# EAGLE design Blaze (EAGLE 9.6.1)
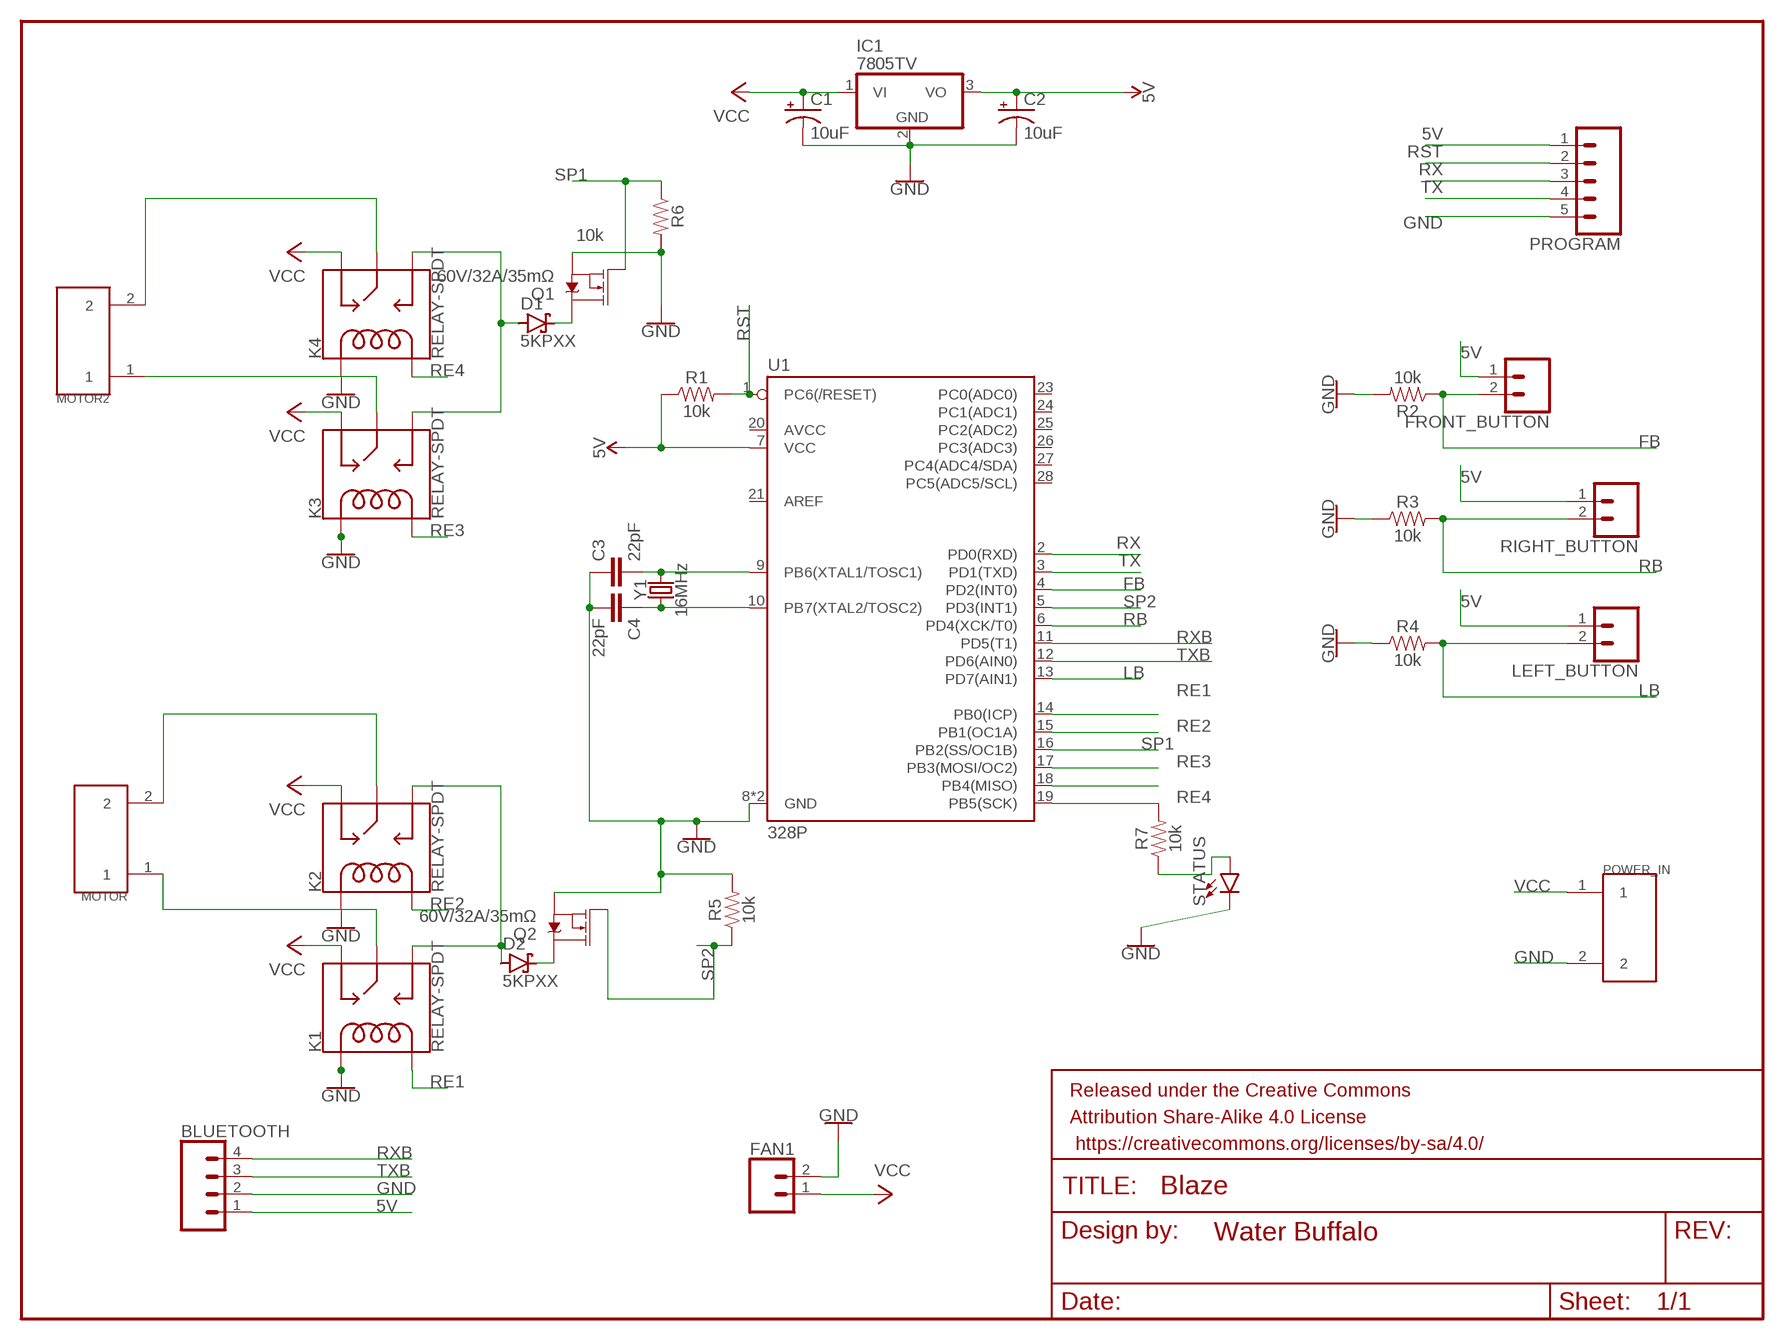
[diagram p0: schematic, sheet 1]

## Parts
BLUETOOTH  CONN_04PTH  [1X04]
C1  10uF  10UF-POLAR-RADIAL-2.5MM-25V-20%  [CPOL-RADIAL-2.5MM-5MM]
C2  10uF  10UF-POLAR-RADIAL-2.5MM-25V-20%  [CPOL-RADIAL-2.5MM-5MM]
C3  22pF  22PF-PTH-2.54MM-200V-5%  [CAP-PTH-2.54]
C4  22pF  22PF-PTH-2.54MM-200V-5%  [CAP-PTH-2.54]
D1  5KPXX  [P6T15]
D2  5KPXX  [P6T15]
FAN1  CONN_02  [1X02]
FRAME1  FRAME-LETTERNO_PACKAGE  [DUMMY]
FRONT_BUTTON  CONN_02  [1X02]
IC1  7805TV  [TO220V]
K1  RELAY-SPDT  [RELAY_G5LE]
K2  RELAY-SPDT  [RELAY_G5LE]
K3  RELAY-SPDT  [RELAY_G5LE]
K4  RELAY-SPDT  [RELAY_G5LE]
LEFT_BUTTON  CONN_02  [1X02]
MOTOR  10M_TERM  [10MM_TERM]
MOTOR2  10M_TERM  [10MM_TERM]
POWER_IN  10M_TERM  [10MM_TERM]
PROGRAM  CONN_05  [1X05]
Q1  60V/32A/35mΩ  MOSFET-NCH-FQP30N06L  [TO220V]
Q2  60V/32A/35mΩ  MOSFET-NCH-FQP30N06L  [TO220V]
R1  10k  10KOHM-HORIZ-1/4W-1%  [AXIAL-0.3]
R2  10k  10KOHM-HORIZ-1/4W-1%  [AXIAL-0.3]
R3  10k  10KOHM-HORIZ-1/4W-1%  [AXIAL-0.3]
R4  10k  10KOHM-HORIZ-1/4W-1%  [AXIAL-0.3]
R5  10k  10KOHM-HORIZ-1/4W-1%  [AXIAL-0.3]
R6  10k  10KOHM-HORIZ-1/4W-1%  [AXIAL-0.3]
R7  10k  10KOHM-HORIZ-1/4W-1%  [AXIAL-0.3]
RIGHT_BUTTON  CONN_02  [1X02]
STATUS  LED3MM  [LED_3MM]
U1  328P  ATMEGA328P_PDIP  [DIP28]
Y1  16MHz  CRYSTAL-16MHZPTH-HC49US  [HC49US]

## Nets
5V: BLUETOOTH.1 C2.1(+) FRONT_BUTTON.1 IC1.3(VO) LEFT_BUTTON.1 PROGRAM.1 R1.P$1 RIGHT_BUTTON.1 U1.7(VCC)
FB: FRONT_BUTTON.2 R2.P$1 U1.4(PD2(INT0))
GND: BLUETOOTH.2 C1.2(-) C2.2(-) C3.1 C4.2 FAN1.2 IC1.2(GND) K1.2(COIL1) K2.2(COIL1) K3.2(COIL1) K4.2(COIL1) POWER_IN.2 PROGRAM.5 Q1.3(S) Q2.3(S) R2.P$2 R3.P$1 R4.P$1 R5.P$2 R6.P$2 STATUS.K(C) U1.8(GND) U1.22(GND)
LB: LEFT_BUTTON.2 R4.P$2 U1.13(PD7(AIN1))
MOTOR2_1 [Motor]: K3.1(MAIN) MOTOR2.1
MOTOR2_2 [Motor]: K4.1(MAIN) MOTOR2.2
N$1 [Motor]: D2.A K1.3(NO) K2.3(NO)
N$2 [Motor]: D1.C Q1.2(D)
N$3 [Motor]: K2.1(MAIN) MOTOR.2
N$4 [Motor]: K1.1(MAIN) MOTOR.1
N$5: R7.P$1 STATUS.A
N$7 [Motor]: D1.A K3.3(NO) K4.3(NO)
N$8 [Motor]: D2.C Q2.2(D)
N$11: C3.2 U1.9(PB6(XTAL1/TOSC1)) Y1.2
N$12: C4.1 U1.10(PB7(XTAL2/TOSC2)) Y1.1
RB: R3.P$2 RIGHT_BUTTON.2 U1.6(PD4(XCK/T0))
RE1: K1.5(COIL2) U1.14(PB0(ICP))
RE2: K2.5(COIL2) U1.15(PB1(OC1A))
RE3: K3.5(COIL2) U1.17(PB3(MOSI/OC2))
RE4: K4.5(COIL2) U1.18(PB4(MISO))
RST: PROGRAM.2 R1.P$2 U1.1(PC6(/RESET))
RX: PROGRAM.3 U1.2(PD0(RXD))
RXB: BLUETOOTH.4 U1.11(PD5(T1))
SP1: Q1.1(G) R6.P$1 U1.16(PB2(SS/OC1B))
SP2: Q2.1(G) R5.P$1 U1.5(PD3(INT1))
STAT_LED: R7.P$2 U1.19(PB5(SCK))
TX: PROGRAM.4 U1.3(PD1(TXD))
TXB: BLUETOOTH.3 U1.12(PD6(AIN0))
VCC [VCC]: C1.1(+) FAN1.1 IC1.1(VI) K1.4(NC) K2.4(NC) K3.4(NC) K4.4(NC) POWER_IN.1
Unconnected: U1.20(AVCC) U1.21(AREF) U1.23(PC0(ADC0)) U1.24(PC1(ADC1)) U1.25(PC2(ADC2)) U1.26(PC3(ADC3)) U1.27(PC4(ADC4/SDA)) U1.28(PC5(ADC5/SCL))

## Library data of the parts
BLUETOOTH = SparkFun-Connectors:CONN_04: Multi connection point. Often used as Generic Header-pin footprint for 0.1 inch spaced/style header connections On any of the 0.1 inch spaced packages, you can populate with these: Break Away Headers - Straight <https://www.sparkfun.com/products/116> (PRT-00116) Break Away Male Headers - Right Angle <https://www.sparkfun.com/products/553> (PRT-00553) Female Headers <https://www.sparkfun.com/products/115> (PRT-00115) Break Away Headers - Machine Pin <https://www.sparkfun.com/products/117> (PRT-00117) Break Away Female Headers - Swiss Machine Pin <https://www.sparkfun.com/products/743> (PRT-00743) For SCREWTERMINALS and SPRING TERMINALS visit here: Screw Terimnals on SparkFun.com <https://www.sparkfun.com/search/results?term=Screw+Terminals> (5mm/3.5mm/2.54mm spacing) This device is also useful as a general connection point to wire up your design to another part of your project. Our various solder wires solder well into these plated through hole pads. Hook-Up Wire - Assortment (Stranded, 22 AWG) <https://www.sparkfun.com/products/11375> (PRT-11375) Hook-Up Wire - Assortment (Solid Core, 22 AWG) <https://www.sparkfun.com/products/11367> (PRT-11367) View the entire wire category on our website here <https://www.sparkfun.com/categories/141> Special notes: Molex polarized connector foot print use with SKU : PRT-08231 with associated crimp pins and housings. 1MM SMD Version SKU: PRT-10208; PROD_ID: CONN-09696
C1 C2 = SparkFun-Capacitors:10UF-POLAR: 10.0µF polarized capacitors A capacitor is a passive two-terminal electrical component used to store electrical energy temporarily in an electric field.; PROD_ID: CAP-08440
C3 C4 = SparkFun-Capacitors:22PF: 22pF ceramic capacitors A capacitor is a passive two-terminal electrical component used to store electrical energy temporarily in an electric field.; PROD_ID: CAP-09128
D1 D2 = diode:5KPXX: DIODE transient voltage suppressor
FAN1 FRONT_BUTTON LEFT_BUTTON RIGHT_BUTTON = SparkFun-Connectors:CONN_02: Multi connection point. Often used as Generic Header-pin footprint for 0.1 inch spaced/style header connections On any of the 0.1 inch spaced packages, you can populate with these: Break Away Headers - Straight <https://www.sparkfun.com/products/116> (PRT-00116) Break Away Male Headers - Right Angle <https://www.sparkfun.com/products/553> (PRT-00553) Female Headers <https://www.sparkfun.com/products/115> (PRT-00115) Break Away Headers - Machine Pin <https://www.sparkfun.com/products/117> (PRT-00117) Break Away Female Headers - Swiss Machine Pin <https://www.sparkfun.com/products/743> (PRT-00743) For SCREWTERMINALS and SPRING TERMINALS visit here: Screw Terimnals on SparkFun.com <https://www.sparkfun.com/search/results?term=Screw+Terminals> (5mm/3.5mm/2.54mm spacing) This device is also useful as a general connection point to wire up your design to another part of your project. Our various solder wires solder well into these plated through hole pads. Hook-Up Wire - Assortment (Stranded, 22 AWG) <https://www.sparkfun.com/products/11375> (PRT-11375) Hook-Up Wire - Assortment (Solid Core, 22 AWG) <https://www.sparkfun.com/products/11367> (PRT-11367) View the entire wire category on our website here <https://www.sparkfun.com/categories/141> Special notes: Molex polarized connector foot print use with: PRT-08233 with associated crimp pins and housings. 2.54_SCREWTERM for use with PRT-10571. 3.5mm Screw Terminal footprints for PRT-08084 5mm Screw Terminal footprints for use with PRT-08432
FRAME1 = SparkFun-Aesthetics:FRAME-LETTER: Schematic Frame - Letter Standard 8.5x11 US Letter frame; DESIGNER: Water Buffalo; VERSION: v01
IC1 = linear:78*: Positive VOLTAGE REGULATOR Source: http://cache.national.com/ds/LM/LM78L05.pdf http://www.fairchildsemi.com/ds/LM/LM7805.pdf
K1-K4 = SparkFun-Electromechanical:RELAY-SPDT: SPDT Electromechanical Relay Single-pole, double-throw sealed relays. When current is applied to the coil, it throws a simple changeover switch, terminating the connection from the NC contact to ground and closing the NO contact. Use them to switch high voltage/high current devices. SparkFun Products JQX-15F: Relay SPDT Sealed - 20A <https://www.sparkfun.com/products/10924> (COM-10924) JZC-11F: Relay SPDT Sealed <https://www.sparkfun.com/products/100> (COM-00100); PROD_ID: COMP-14214
MOTOR MOTOR2 POWER_IN = 10mm_term:10M_TERM
PROGRAM = SparkFun-Connectors:CONN_05: Multi connection point. Often used as Generic Header-pin footprint for 0.1 inch spaced/style header connections On any of the 0.1 inch spaced packages, you can populate with these: Break Away Headers - Straight <https://www.sparkfun.com/products/116> (PRT-00116) Break Away Male Headers - Right Angle <https://www.sparkfun.com/products/553> (PRT-00553) Female Headers <https://www.sparkfun.com/products/115> (PRT-00115) Break Away Headers - Machine Pin <https://www.sparkfun.com/products/117> (PRT-00117) Break Away Female Headers - Swiss Machine Pin <https://www.sparkfun.com/products/743> (PRT-00743) For SCREWTERMINALS and SPRING TERMINALS visit here: Screw Terimnals on SparkFun.com <https://www.sparkfun.com/search/results?term=Screw+Terminals> (5mm/3.5mm/2.54mm spacing) This device is also useful as a general connection point to wire up your design to another part of your project. Our various solder wires solder well into these plated through hole pads. Hook-Up Wire - Assortment (Stranded, 22 AWG) <https://www.sparkfun.com/products/11375> (PRT-11375) Hook-Up Wire - Assortment (Solid Core, 22 AWG) <https://www.sparkfun.com/products/11367> (PRT-11367) View the entire wire category on our website here <https://www.sparkfun.com/categories/141> Special notes: Molex polarized connector foot print use with SKU : PRT-08231 with associated crimp pins and housings. 1MM SMD Version SKU: PRT-10208
Q1 Q2 = SparkFun-DiscreteSemi:MOSFET-NCH: N-channel MOSFETs Voltage controlled devices that allow control of high current outputs. SparkFun Products: SparkFun OpenScale <https://www.sparkfun.com/products/13261> SparkFun Digital Sandbox <https://www.sparkfun.com/products/12651> SparkFun Monster Moto Shield <https://www.sparkfun.com/products/10182> SparkFun MOSFET Power Controller <https://www.sparkfun.com/products/11214>; PROD_ID: TRANS-10060
R1-R7 = SparkFun-Resistors:10KOHM: 10kΩ resistor A resistor is a passive two-terminal electrical component that implements electrical resistance as a circuit element. Resistors act to reduce current flow, and, at the same time, act to lower voltage levels within circuits. - Wikipedia; PROD_ID: RES-12183
STATUS = SparkFun-LED:LED: LED (Generic) Standard schematic elements and footprints for 5mm, 3mm, 1206, and 0603 sized LEDs. Generic LEDs with no color specified.; PROD_ID: DIO-08794
U1 = SparkFun-IC-Microcontroller:ATMEGA328P_PDIP: Atmel 328P Through hole ATMEGA328P uC used in the Arduino 32kb flash, 1k EEPROM, 2k SRAM Datasheet <http://www.sparkfun.com/datasheets/Components/SMD/ATMega328.pdf> SparkFun Products Storefront component: AVR 28 Pin 20MHz 32K 6A/D - ATMega328P <https://www.sparkfun.com/products/9061> (COM-09061) SparkFun Simon Says - Through-Hole Soldering Kit <https://www.sparkfun.com/products/10547> (KIT-10547) SparkFun Learn to Solder - Simon Says <https://www.sparkfun.com/products/13708> (KIT-13708) SparkFun BigTime Watch Kit <https://www.sparkfun.com/products/11734> (KIT-11734) SparkFun ClockIt <https://www.sparkfun.com/products/10930> (KIT-10930) SparkFun Serial Enabled LCD Kit <https://www.sparkfun.com/products/10097> (LCD-10097) SparkFun Simon Tilts - Through Hole Soldering Kit <https://www.sparkfun.com/products/12634> (KIT-12634) SparkFun Frequency Counter Kit <https://www.sparkfun.com/products/10140> (KIT-10140) FabFM Radio Kit <https://www.sparkfun.com/products/11043> (KIT-11043) SparkFun Binary Blaster Kit <https://www.sparkfun.com/products/12037> (KIT-12037) SparkFun Metro-Gnome <https://www.sparkfun.com/products/9236> (KIT-09236) ATmega328 with Arduino Optiboot (Uno) <https://www.sparkfun.com/products/10524> (DEV-10524); PROD_ID: IC-09136
Y1 = SparkFun-Clocks:CRYSTAL-16MHZ: 16MHz Crystal Digikey Example <http://www.digikey.com/product-search/en?keywords=535-9122-1-ND> Frequency: 16MHz Frequency Stability: ±50ppm Frequency Tolerance: ±20ppm Load Capacitance: 18pF SparkFun Products: Pro Micro -5V/16MHz <https://www.sparkfun.com/products/12640> SparkFun Serial Enabled LCD Kit <https://www.sparkfun.com/products/10097>; PROD_ID: XTAL-08181; SF_ID: COM-00536

## Net classes
0 default: width 0.15 mm
1 Motor: width 2 mm, clearance 0.508 mm
2 VCC: clearance 0.762 mm

## Board
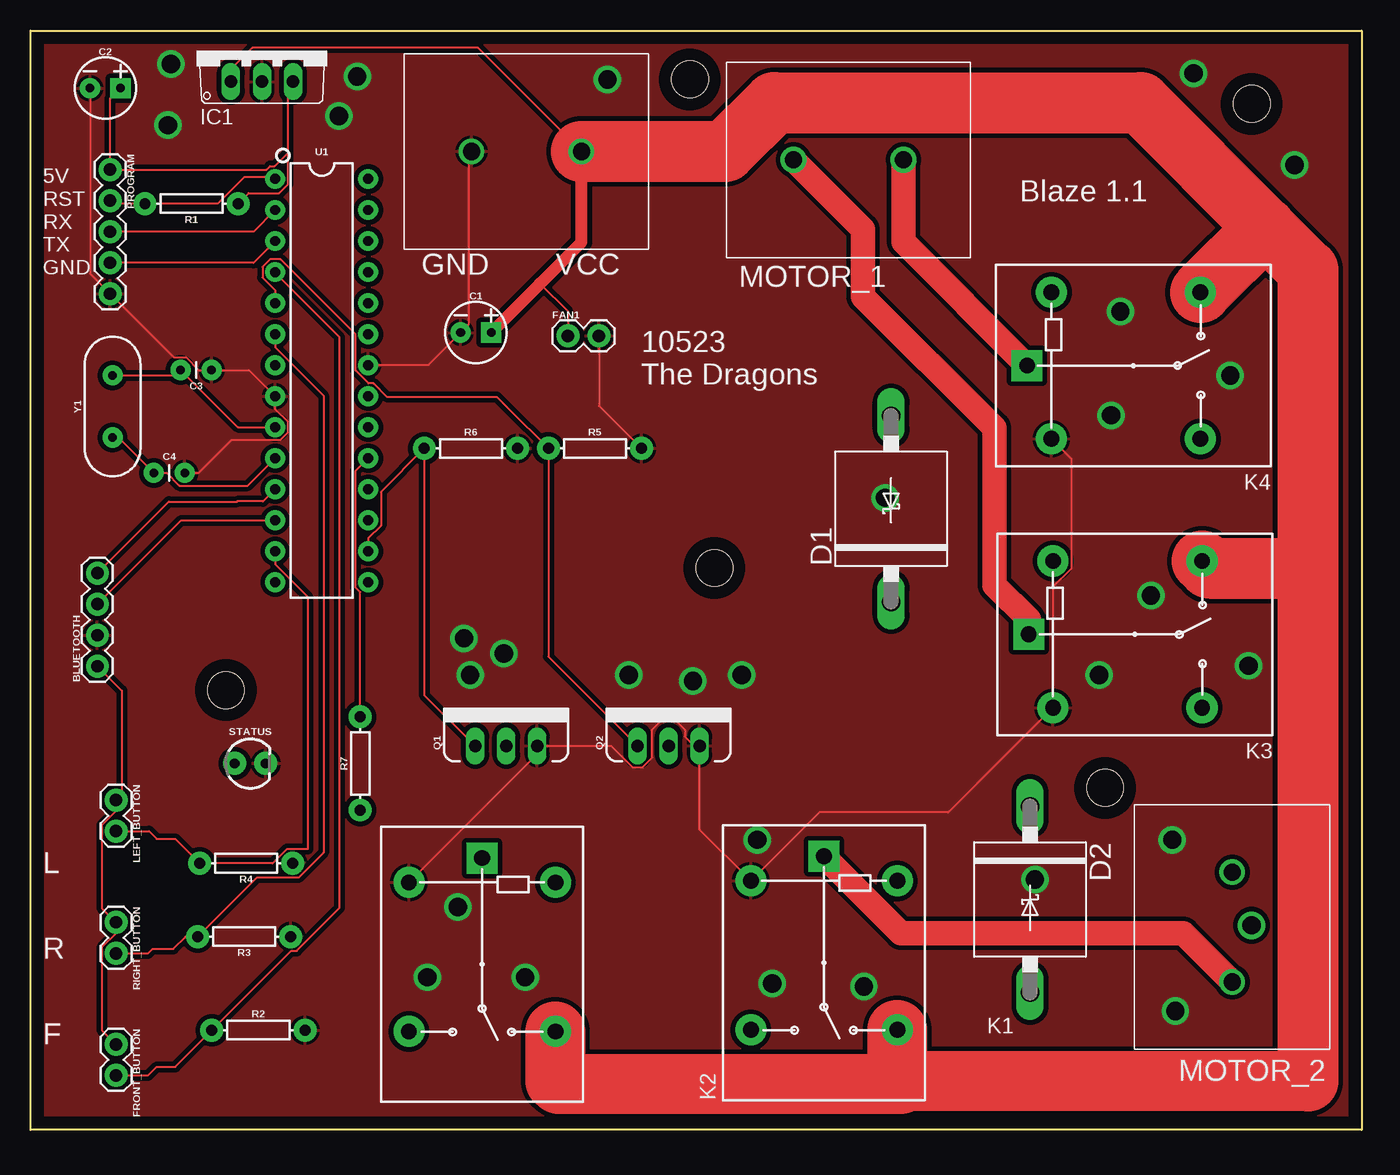
[diagram p1: board, top side]
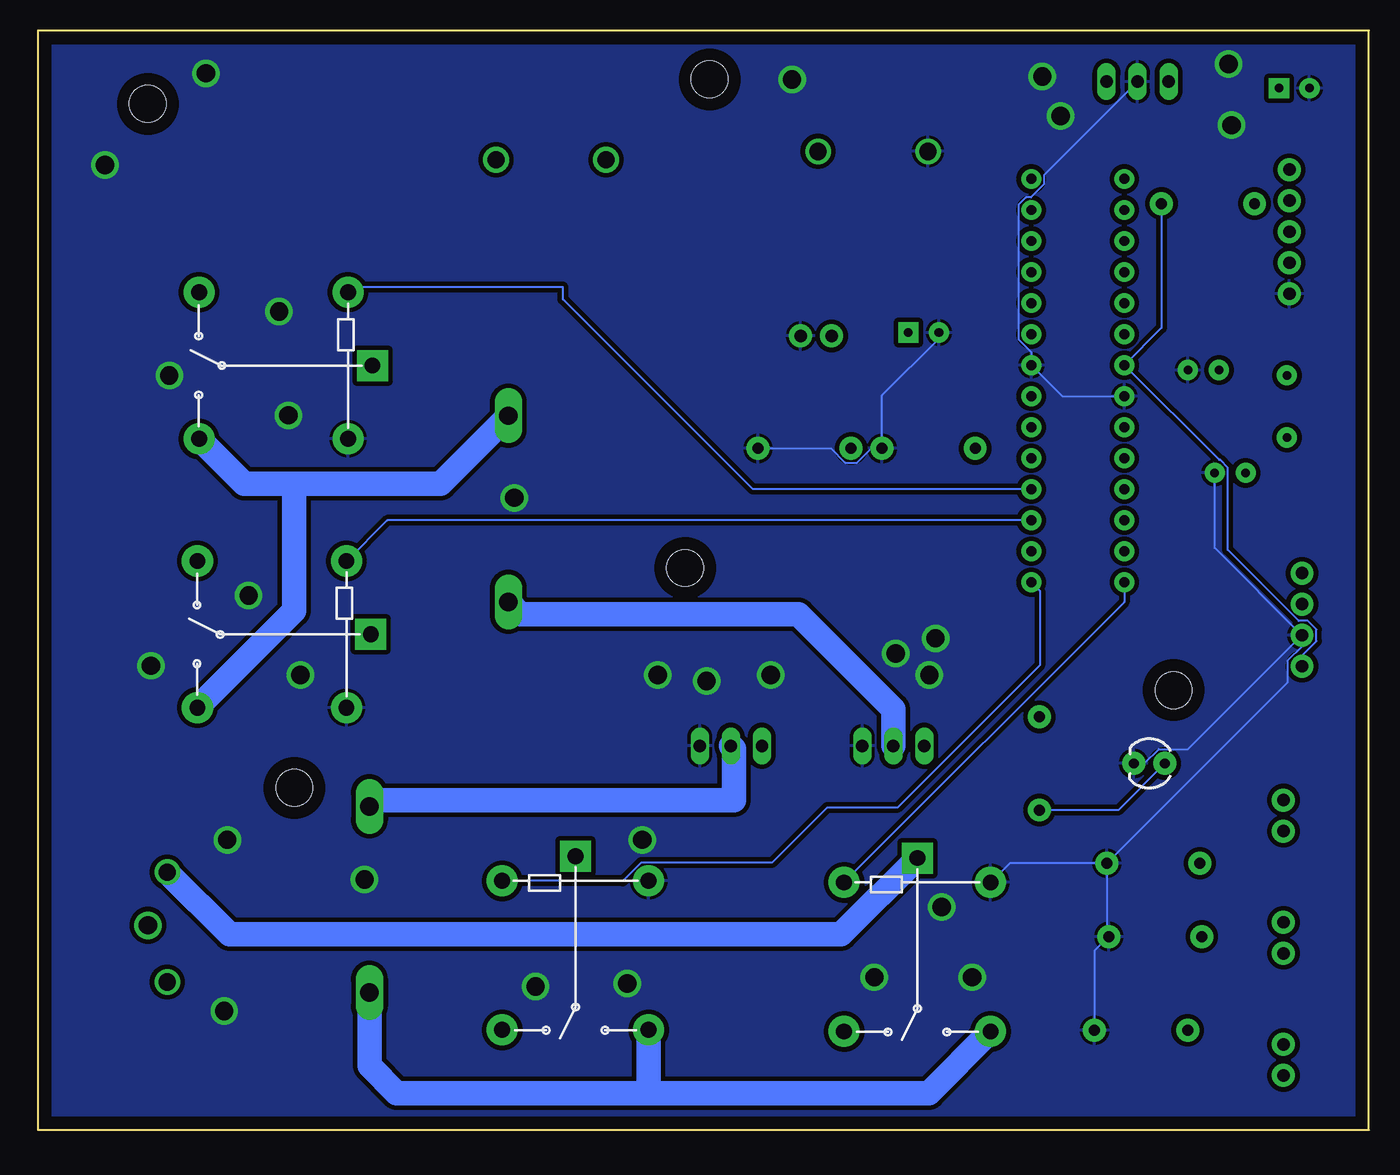
[diagram p2: board, bottom side, seen from below]

Size 109 x 90 mm. Coordinates in mm from the lower left corner, seen from the top.
Outline: 0,0 0,90 109,90 109,0 0,0
Copper layers (1*16): Top 0.035mm / dielectric 1.5mm / Bottom 0.035mm
Design rules "default *": minimum track width 6mil, minimum drill 0.35mm, track to track 15mil, track to pad 6mil, pad to pad 6mil, via to via 6mil, smd to smd 6mil, copper to edge 40mil, drill to drill 6mil, minimum pad ring 10mil, minimum via ring 8mil, stop-mask expansion 4mil, vias tented up to drill 0mil, thermal gap 10mil
Holes 3 mm at 100,84 56,46 16,36 88,28 54,86

### Footprints (pad centres in the part's own frame; a part is rotated, then mirrored left to right if it is on the bottom)
1X04 = drill 1.016 pad 1.88: 1 0,0; 2 2.54,0; 3 5.08,0; 4 7.62,0
CPOL-RADIAL-2.5MM-5MM = drill 0.7 pad 1.651 square: 1 1.25,0 | drill 0.7 pad 1.651: 2 -1.25,0
CAP-PTH-2.54 = drill 0.7 pad 1.651: 1 -1.27,0; 2 1.27,0
P6T15 = drill 1.499 long: A 7.62,0; C -7.62,0
1X02 = drill 1.016 pad 1.88: 1 0,0; 2 2.54,0
TO220V = drill 1.016 long: 1 -2.54,-2.54; 2 0,-2.54; 3 2.54,-2.54
RELAY_G5LE = drill 1.3 pad 2.54 square: 1 8.52,-0.005 | drill 1.3 pad 2.54: 2 6.52,5.995; 3 -5.68,5.995; 4 -5.68,-6.005; 5 6.52,-6.005
10MM_TERM = drill 1.4: 1 0,4.5; 2 0,-4.5
1X05 = drill 1.016 pad 1.88: 1 0,0; 2 2.54,0; 3 5.08,0; 4 7.62,0; 5 10.16,0
TO220V' = drill 1.016 long: 1 -2.54,0; 2 0,0; 3 2.54,0
AXIAL-0.3 = drill 0.9 pad 1.88: P$1 -3.81,0; P$2 3.81,0
LED_3MM = drill 0.813 pad 1.88: A -1.27,0; K 1.27,0
DIP28 = drill 0.813 pad 1.626: 1 -16.51,-3.81; 2 -13.97,-3.81; 3 -11.43,-3.81; 4 -8.89,-3.81; 5 -6.35,-3.81; 6 -3.81,-3.81; 7 -1.27,-3.81; 8 1.27,-3.81; 9 3.81,-3.81; 10 6.35,-3.81; 11 8.89,-3.81; 12 11.43,-3.81; 13 13.97,-3.81; 14 16.51,-3.81; 15 16.51,3.81; 16 13.97,3.81; 17 11.43,3.81; 18 8.89,3.81; 19 6.35,3.81; 20 3.81,3.81; 21 1.27,3.81; 22 -1.27,3.81; 23 -3.81,3.81; 24 -6.35,3.81; 25 -8.89,3.81; 26 -11.43,3.81; 27 -13.97,3.81; 28 -16.51,3.81
HC49US = drill 0.7 pad 1.651: 1 -2.54,0; 2 2.54,0

### Placement (x,y rotation side)
BLUETOOTH  5.48,37.96 90 top
C1  36.47,65.28 0 top
C2  6.12,85.28 0 top
C3  13.56,62.21 180 top
C4  11.36,53.79 0 top
D1  70.47,50.85 90 top
D2  81.85,18.86 270 top
FAN1  44,65 0 top
FRAME1  7.48,40.15 90 top
FRONT_BUTTON  7,7 270 top
IC1  18.95,88.36 0 top
K1  36.98,13.74 90 top
K2  64.98,13.87 90 top
K3  90.26,40.57 180 top
K4  90.13,62.57 180 top
LEFT_BUTTON  7,27 270 top
MOTOR  98.41,16.61 0 top
MOTOR2  66.98,79.42 90 top
POWER_IN  40.61,80.1 270 top
PROGRAM  6.52,78.61 270 top
Q1  60V/32A/35mΩ  [TO220V']  38.95,31.44 0 top
Q2  60V/32A/35mΩ  [TO220V']  52.25,31.44 0 top
R1  13.18,75.83 180 top
R2  18.66,8.17 0 top
R3  17.5,15.83 180 top
R4  17.66,21.83 180 top
R5  46.22,55.79 0 top
R6  36.06,55.79 0 top
R7  27,30 90 top
RIGHT_BUTTON  7,17 270 top
STATUS  18,30 0 top
U1  23.85,61.34 270 top
Y1  6.72,59.23 90 top

### Tracks (layer width: path | path; a pad name or v marks a point on that pad's centre or on a via)
5V
  Top 0.152: C2.1 6.52,84.43 PROGRAM.1 19.33,78.61 19.61,78.89 19.97,78.89 21.08,80 | R1.P$1 17.85,76.69 20.36,76.69 21.08,77.42 21.08,80 | IC1.3 21.08,85.41 21.08,80 | BLUETOOTH.1 7.48,35.96 7.48,27.48 LEFT_BUTTON.1 7,26.11 5.83,24.94 5.83,18.17 RIGHT_BUTTON.1 7,16.11 5.83,14.94 5.83,8.17 FRONT_BUTTON.1
  Bottom 0.152: R1.P$1 16.99,65.66 U1.7 12.27,54.84 12.19,54.84 11.58,54.23 11.58,47.48 5.76,41.67 5,41.67 4.31,40.98 4.31,40.02 5.48,38.85 BLUETOOTH.1
FB
  Top 0.152: U1.4 20.04,70.16 25.3,64.9 25.3,18.17 21.79,14.66 21.34,14.66 R2.P$1 11.85,5.17 10.34,5.17 9.63,4.46 FRONT_BUTTON.2
GND  (via drill 1.5)
  Top 0.152: C2.2 4.87,70.1 PROGRAM.5 11.71,63.26 12.73,63.26 13.78,62.21 C3.1 17.9,62.21 U1.8 20.04,59 21.08,57.96 21.08,57.1 20.47,56.49 16.46,56.49 13.76,53.79 C4.2 | K4.2 85.24,54.95 85.24,45.95 83.74,44.46 K3.2 75.17,26 64.59,26 K2.2 54.79,24.59 54.79,31 | U1.22 32.55,62.61 C1.2 35.86,65.92 35.86,79.85 POWER_IN.2 | 54.79,31 Q2.3 | K1.2 41.49,30.77 Q1.3 47.55,31.44 49.3,29.69 50.12,29.69 50.9,30.47 50.9,32.76 51.69,33.55 52.81,33.55 53.6,32.76 53.6,32.19 54.79,31 | FAN1.2 46.54,59.28 R5.P$2
  Bottom 0.152: IC1.2 26.62,78.15 26.62,77.42 27.69,76.35 28.09,76.35 28.7,75.74 28.7,64.72 27.66,63.68 U1.22 25.12,60.07 U1.8 | R4.P$1 21.47,15.99 R3.P$1 22.47,14.67 R2.P$2 | R4.P$1 29.41,21.83 K1.2 | R4.P$1 6.65,36.65 6.65,38.44 5.48,39.61 BLUETOOTH.2 | BLUETOOTH.2 12.63,47.65 C4.2 | R5.P$2 44.06,55.79 42.89,54.62 41.93,54.62 40.76,55.79 R6.P$2 39.87,60.13 35.22,64.78 C1.2 | STATUS.K 18.38,30 17.21,31.17 14.83,31.17 BLUETOOTH.2
  other vias: 59.5,23.75 58.25,37.25 54.25,36.75 49,37.25 38.75,39 36,37.25 35.5,40.25 35,18.25 32.5,12.5 40.5,12.5 60.75,12 68.25,11.75 82.25,20.5 70,51.75 93.5,23.75 93.75,9.75 87.5,37.25 91.75,43.75 99.75,38 88.5,58.5 98.25,61.75 89.25,67 103.5,79 95.25,86.5 47.25,86 26.75,86.25 25.25,83 11.5,87.25 11.25,82.25
  pour Top (isolate 0.015): 0,90 0,0 108,0 108,90
  pour Bottom (isolate 0.015): 1,89 108,89 108,1 1,1
LB
  Top 0.152: U1.13 20.04,46.3 22.7,43.65 22.7,23 22.69,23 20.99,23 19.82,21.83 R4.P$2 11.85,23.83 10.33,23.83 9.7,24.46 LEFT_BUTTON.2
MOTOR2_1
  Top 2: MOTOR2.1 68.17,73.73 68.17,68.23 78.93,57.47 78.93,44.6 81.74,41.79 K3.1
MOTOR2_2
  Top 2: K4.1 71.48,72.7 MOTOR2.2
N$1
  Bottom 2: K1.3 36.05,3 59,3 | 59,3 59,8.18 K2.3 | 59,3 79.61,3 81.85,5.24 D2.A
N$2
  Bottom 2: Q1.2 38.95,34.44 46.74,42.23 69.47,42.23 D1.C
N$3
  Top 2: K2.1 71.27,16.11 94.41,16.11 MOTOR.2
N$4
  Bottom 2: K1.1 43.24,16 93.3,16 MOTOR.1
N$5
  Bottom 0.152: STATUS.A 20.54,26.19 R7.P$1
N$7
  Bottom 2: D1.A 76.04,52.9 88,52.9 | K3.3 88,42.52 88,52.9 | K4.3 92.13,52.9 88,52.9
N$8
  Bottom 2: D2.C 81.33,27 52,27 52,31.19 Q2.2
N$11
  Top 0.152: Y1.2 11.85,61.77 C3.2 16.97,57.53 U1.9
N$12
  Top 0.152: Y1.1 7.19,56.69 C4.1 11.14,53.79 12.19,52.74 17.79,52.74 U1.10
N$33  (via drill 1.5)
  other vias: 100,16.75
RB
  Top 0.152: U1.6 20.04,64.08 24,60.12 24,22.71 21.95,20.66 18.52,20.66 R3.P$2 12.69,15.83 11.69,14.83 10,14.83 9.63,14.46 RIGHT_BUTTON.2
RE1
  Bottom 0.152: U1.14 20.04,43.2 K1.5
RE2
  Bottom 0.152: K2.5 61.1,20.39 59.61,21.89 48.88,21.89 44.38,26.38 38.62,26.38 26.96,38.04 26.96,44.13 U1.15
RE3
  Bottom 0.152: U1.17 80.41,49.91 K3.5
RE4
  Bottom 0.152: U1.18 50.45,52.45 66,68 66,69 83.19,69 K4.5
RST
  Top 0.152: U1.1 19.89,78 17.51,78 15.34,75.83 R1.P$2 6.76,75.83 PROGRAM.2
RX
  Top 0.152: U1.2 18.26,73.53 PROGRAM.3
RXB
  Top 0.152: BLUETOOTH.4 11.33,51.43 16.91,51.43 16.93,51.45 19.04,51.45 U1.11
SP1
  Top 0.152: Q1.1 32.25,35.6 R6.P$1 28.7,52.24 28.7,49.48 27.66,48.44 U1.16
SP2
  Top 0.152: Q2.1 42.41,38.74 R5.P$1 39.1,59.1 38.2,60 29.2,60 28.09,61.11 27.69,61.11 26.61,62.19 26.61,65.13 20.47,71.27 19.61,71.27 19,70.66 19,69.77 20.04,68.73 U1.5
STAT_LED
  Top 0.152: R7.P$2 27,44.02 26.62,44.4 26.62,53.95 U1.19
TX
  Top 0.152: U1.3 18.26,70.99 PROGRAM.4
TXB
  Top 0.152: BLUETOOTH.3 12.35,49.91 U1.12
VCC
  Top 0.152: POWER_IN.1 36.64,88.57 18.16,88.57 16.41,86.82 IC1.1 | 41.72,69.28 44,67 FAN1.1
  Top 1: C1.1 41.72,69.28 45.11,72.67 POWER_IN.1
  Top 4.6: 43.25,3.75 42.98,4.01 | 71.25,3.75 71,4 70.98,4.01
  Top 4.9: 42.98,4.01 K1.4 | 104.61,4 71,4 | 71.25,3.75 43.25,3.75 | 70.98,4.01 K2.4
  Top 5: POWER_IN.1 56.91,80.1 60.91,84.09 90.91,84.09 101.12,73.88 | 104.61,46 104.61,4 | K3.4 96.52,46 104.61,46 | 101.12,73.88 104.61,70.39 104.61,46 | K4.4 101.11,73.88 101.12,73.88

### Text on the board
tPlace: 5V / RST / RX / TX / GND | GND | VCC | MOTOR_1 | 10523 / The Dragons | L | R | F | MOTOR_2
tNames: Blaze 1.1